# Altium project B802AA.PrjPcb
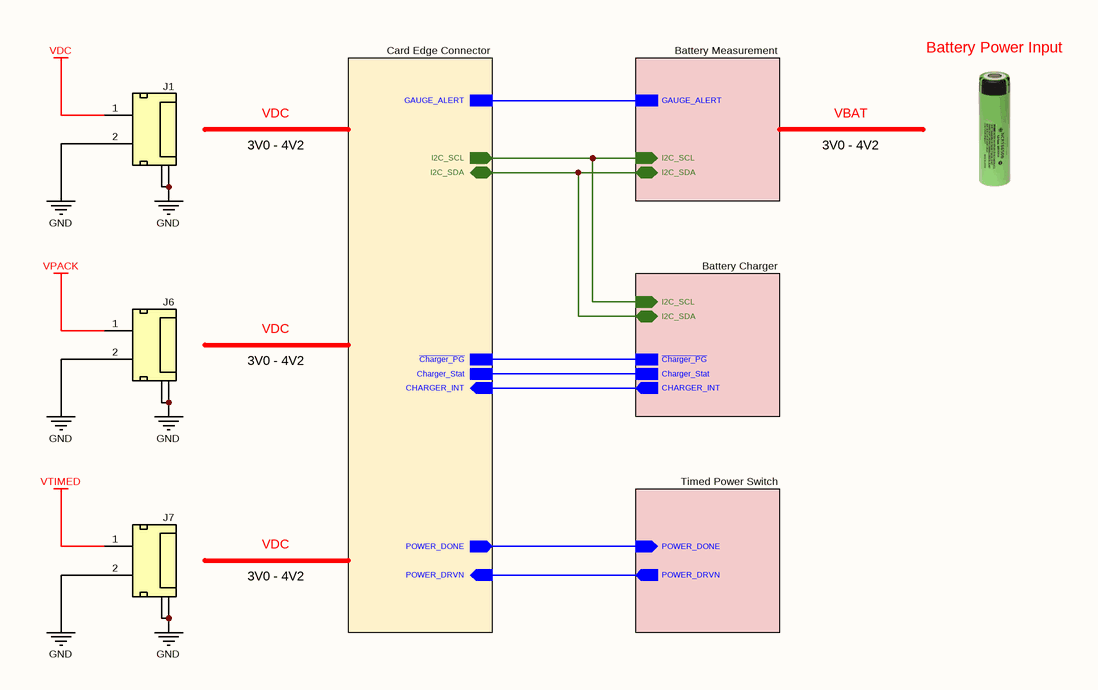
[diagram p0: Block Diagram.SchDoc]
Address1_: Buyuk Kayacik Mah. 4. OSB; Address2_: 103. Cad. No : 12; Address3_: Selcuklu / Konya; Address4_: Türkiye; Copyright_: Copyright 2022 STF Tarim (Commercial Secret); Customer_: STF Irrigation; Engineer_: Gunce Akkoyun; Git_Repo_Address_: www.github.com/akkoyun/B905AA; Module_ID_: B802AA; Organization_: STF Res-Dev; Product_Desc_: P101DA; Product_ID_: P101DA; Revision_: 00.00.01; Version_: R1
5 sheets, 52 parts. Net scope: hierarchical (ports join the sheet entries above them; power ports are global).
Board file: B802AA.PcbDoc
Sheets:
  Block Diagram.SchDoc
    Battery Measurement = Battery Measurement.SchDoc
    Battery Charger = Battery Charger.SchDoc
    Timed Power Switch = Timed Power Switch.SchDoc
    Card Edge Connector = Card Edge Connector.SchDoc

## Sheet Block Diagram.SchDoc: Block Diagram
size 292 x 193 mm; SheetNumber: 1; SheetTotal: 4

### Parts
J1  2P SMD Tunic Connector  [Connector_Tunic 2P]  (value not drawn)
J6  2P SMD Tunic Connector  [Connector_Tunic 2P]  (value not drawn)
J7  2P SMD Tunic Connector  [Connector_Tunic 2P]  (value not drawn)

### Sub-sheets
Battery Charger = Battery Charger.SchDoc: ~{Charger_PG}, Charger_Stat, I2C_SDA (bidir), I2C_SCL (in), CHARGER_INT (out)
Battery Measurement = Battery Measurement.SchDoc: GAUGE_ALERT, I2C_SDA (bidir), I2C_SCL (in)
Card Edge Connector = Card Edge Connector.SchDoc: POWER_DONE (out), POWER_DRVN (in), Charger_Stat, ~{Charger_PG}, CHARGER_INT (in), I2C_SDA (bidir), GAUGE_ALERT, I2C_SCL (out)
Timed Power Switch = Timed Power Switch.SchDoc: POWER_DONE (in), POWER_DRVN (out)

### Nets
GND: J1.2(Pin2) J1.3(GND) J1.4(GND) J6.2(Pin2) J6.3(GND) J6.4(GND) J7.2(Pin2) J7.3(GND) J7.4(GND)
VDC: J1.1(Pin1)
VPACK: J6.1(Pin1)
VTIMED: J7.1(Pin1)
~{Charger_PG}: sheet Battery Charger/~{Charger_PG}, sheet Card Edge Connector/~{Charger_PG}
CHARGER_INT: sheet Battery Charger/CHARGER_INT, sheet Card Edge Connector/CHARGER_INT
Charger_Stat: sheet Battery Charger/Charger_Stat, sheet Card Edge Connector/Charger_Stat
GAUGE_ALERT: sheet Battery Measurement/GAUGE_ALERT, sheet Card Edge Connector/GAUGE_ALERT
I2C_SCL: sheet Battery Measurement/I2C_SCL, sheet Battery Charger/I2C_SCL, sheet Card Edge Connector/I2C_SCL
I2C_SDA: sheet Battery Measurement/I2C_SDA, sheet Battery Charger/I2C_SDA, sheet Card Edge Connector/I2C_SDA
POWER_DONE: sheet Timed Power Switch/POWER_DONE, sheet Card Edge Connector/POWER_DONE
POWER_DRVN: sheet Timed Power Switch/POWER_DRVN, sheet Card Edge Connector/POWER_DRVN

### Notes on the sheet
- Battery Power Input
- VDC
- 3V0 - 4V2
- VBAT
- © 2021 All rights reserved.
  This document may not, in whole or in part, be copied, photocopied, reproduced, translated or converted to any electronic or machine readable from without prior written permission of Mehmet Günce Akkoyun.
  Engineer contact : akkoyun@me.com
- Property of
- Engineer :
- Date :
- Size :
- A4
- Time :
- Project :
- Page :
- /
- Customer :
- Product ID :
- Module ID :
- Version :
- File :
- Revision :

### Library data of the parts
J1 J6 J7 = Connector - Mini Tunic 2P (1.25): Mini Tunic Connector with 2P; Manufacturer Name: Molex; Manufacturer Part Number: 53261-0271; Height: 3.55mm; Mouser Part Number: 538-53261-0271; ROHS: Yes

## Sheet Battery Measurement.SchDoc: Battery Measurement
size 292 x 193 mm; SheetNumber: 3; SheetTotal: 4
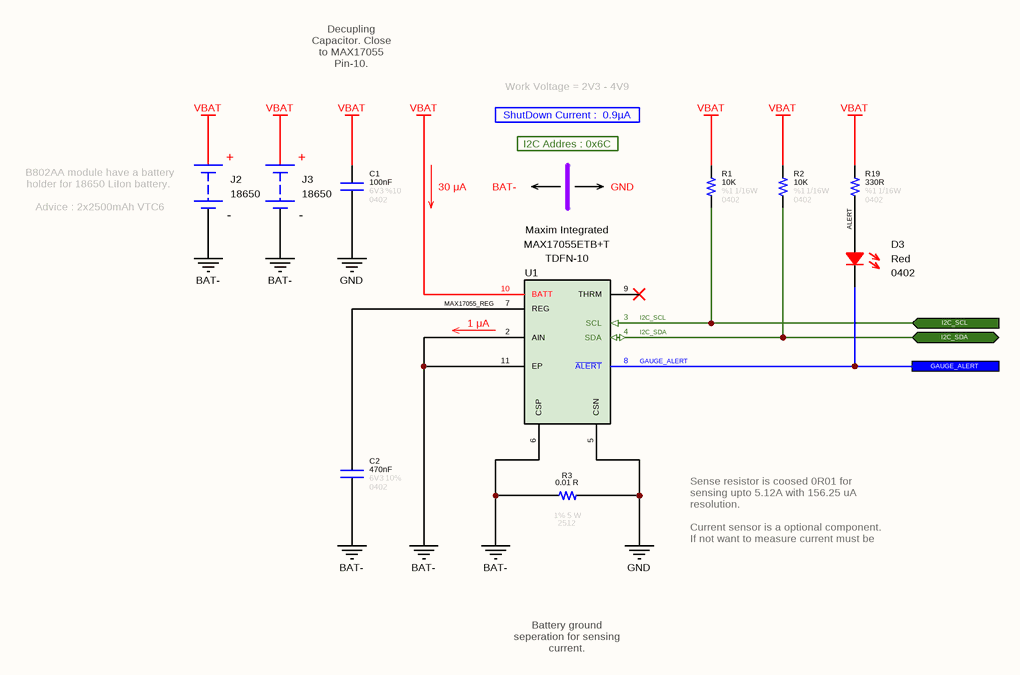
[diagram p1: Battery Measurement.SchDoc]

### Parts
C1  value 100nF  Tolerance: %10  Voltage: 6V3  Case: 0402  [CAPACITOR_0402]  (hidden comment: Capacitor - 100nF [0402] (Ceramic))
C2  value 470nF  Tolerance: 10%  Case: 0402  Voltage: 6V3  [CAPACITOR_0402]  (hidden comment: Capacitor - 470nF [0402] (Ceramic))
D3  Case: 0402  Color: Red  [LED_0402]  (hidden comment: SMD LED (Red))
J2  Battery Size: 18650  [BATTERY_HOLDER - Bat]  (hidden comment: 54)
J3  Battery Size: 18650  [BATTERY_HOLDER - Bat]  (hidden comment: 54)
R1  value 10K  Tolerance: %1  Case: 0402  Power: 1/16W  [RESISTOR_0402]  (hidden comment: 10K - 0402 - %1 - 1/16W)
R2  value 10K  Tolerance: %1  Case: 0402  Power: 1/16W  [RESISTOR_0402]  (hidden comment: 10K - 0402 - %1 - 1/16W)
R3  value 0.01 R  Tolerance: 1%  Power: 5 W  Case: 2512  [RESISTOR_2512 SHUNT]  (hidden comment: 0R01 - 2512 - %1 - 5W)
R19  value 330R  Case: 0402  Tolerance: %1  Power: 1/16W  [RESISTOR_0402]  (hidden comment: 330R - 0402 - %1 - 1/16W)
U1  Manufacturer Name: Maxim Integrated  [TDFN-10]  (hidden comment: MAX17055ETB+T)

### Ports
GAUGE_ALERT, I2C_SCL (in), I2C_SDA (bidir)

### Nets
BAT-: C2.1 J2.2(BAT-) J3.2(BAT-) R3.2 U1.2(AIN) U1.6(CSP) U1.11(EP)
GND: C1.1 R3.1 U1.5(CSN)
VBAT: C1.2 J2.1(BAT+) J3.1(BAT+) R1.2 R2.2 R19.2 U1.10(BATT)
ALERT: D3.2 R19.1
GAUGE_ALERT: D3.1 U1.8(~{ALERT}) ; port GAUGE_ALERT
I2C_SCL: R1.1 U1.3(SCL) ; port I2C_SCL
I2C_SDA: R2.1 U1.4(SDA) ; port I2C_SDA
MAX17055_REG: C2.2 U1.7(REG)

Not connected (* = marked no-connect by the designer): U1 9(THRM)*

### Notes on the sheet
- Decupling Capacitor. Close to MAX17055 Pin-10.
- ShutDown Current :  0.9µA
- Work Voltage = 2V3 - 4V9
- 30 μA
- I2C Addres : 0x6C
- BAT-
- GND
- (near J2) B802AA module have a battery holder for 18650 LiIon battery.
  Advice : 2x2500mAh VTC6
- (near U1) 1 μA
- Sense resistor is coosed 0R01 for sensing upto 5.12A with 156.25 uA resolution.
  Current sensor is a optional component. If not want to measure current must be connect PACK- to GND.
- Battery ground seperation for sensing current.
- © 2021 All rights reserved.
  This document may not, in whole or in part, be copied, photocopied, reproduced, translated or converted to any electronic or machine readable from without prior written permission of Mehmet Günce Akkoyun.
  Engineer contact : akkoyun@me.com
- Property of
- Engineer :
- Date :
- Size :
- A4
- Time :
- Project :
- Page :
- /
- Customer :
- Product ID :
- Module ID :
- Version :
- File :
- Revision :
- (in symbol Connector - 18650 Battery Holder) +; -

### Library data of the parts
C1 = Capacitor - 100nF [0402-6V3]: Capacitor - 100nF [0402-6V3] (Ceramic); Manufacturer Name: AVX; Manufacturer Part Number: 04026D104KAT4A; ComponentLink1Description: Mouser; ComponentLink1URL: https://www.mouser.com.tr/ProductDetail/AVX/04026D104KAT4A?qs=sGAEpiMZZMs0AnBnWHyRQPg4iYkCw7IMED%2F4kpqgf7w%3D; ComponentLink2Description: DataSheet; ComponentLink2URL: https://www.mouser.com.tr/datasheet/2/40/cx5r-776519.pdf
C2 = Capacitor - 470 nF [0402-6V3]: Multilayer Ceramic Capacitors - SMD - 6.3V 470nF X7R 0402 10%; Manufacturer Name: AVX; Manufacturer Part Number: 04026C474KAT2A
D3 = Diode - LED (0402-Red): Standard LEDs - SMD MINI-MOLD ULTRA COMPACT RED; Manufacturer Name: ROHM Semiconductor; Manufacturer Part Number: SML-P12VTT86R; ROHS: Yes; ComponentLink1Description: DataSheet; ComponentLink1URL: https://www.mouser.com.tr/datasheet/2/348/sml-p1-e-1139198.pdf; ComponentLink2Description: Mouser; ComponentLink2URL: https://www.mouser.com.tr/ProductDetail/ROHM-Semiconductor/SML-P12U2TT86R?qs=sGAEpiMZZMseGfSY3csMkRIBDsfU3UCXJTULB5gem9Ta%252Bp%252BvZ709fg%3D%3D
J2 J3 = Connector - 18650 Battery Holder: BATTERY CONTACT CLP 18650 PC PIN; Manufacturer Name: Keystone Electronics; Manufacturer Part Number: 54; Product Type: Battery Holders; RoHS: Yes
R1 R2 = Resistor - 10K [0402]: Thick Film Resistors - SMD 1/16 W 10 KOhm 1%; Manufacturer Name: Vishay; Manufacturer Part Number: CRCW040210K0FKED; ComponentLink1Description: DataSheet; ComponentLink1URL: https://www.mouser.com.tr/datasheet/2/427/dcrcwe3-1762152.pdf; ComponentLink2Description: Mouser; ComponentLink2URL: https://www.mouser.com.tr/ProductDetail/Vishay-Dale/CRCW040210K0FKED?qs=sGAEpiMZZMu61qfTUdNhG2DpbjADlD3GcalbOv9utCY%3D
R3 = Resistor - 0R01 [2512]: Shunt Resistors - SMD 5 W 0.01 Ohm 1%; Manufacturer Part Number: TLRH3APTTE10L0F; Manufacturer Name: KOA Speer
R19 = Resistor - 330R [0402]: Thick Film Resistors - SMD 1/16 W 330 Ohm 1%; Manufacturer Name: Vishay; Manufacturer Part Number: CRCW0402330RFKED; ComponentLink1Description: DataSheet; ComponentLink1URL: https://www.mouser.com.tr/datasheet/2/427/dcrcwe3-1762152.pdf; ComponentLink2Description: Mouser; ComponentLink2URL: https://www.mouser.com.tr/ProductDetail/Vishay-Dale/CRCW0402330RFKED?qs=sGAEpiMZZMu61qfTUdNhG2DpbjADlD3GGS6SwBlLi5Q%3D
U1 = IC - MAX17055: IC FUEL GAUGE MODELGAUGE 10TDFN; Minimum Operating Temperature: - 40 C; Product Type: Battery Gauge; Maximum Operating Temperature: + 85 C; Manufacturer Part Number: MAX17055ETB+T; Case: TDFN-10

## Sheet Battery Charger.SchDoc: Battery Charger
size 292 x 193 mm; SheetNumber: 4; SheetTotal: 5
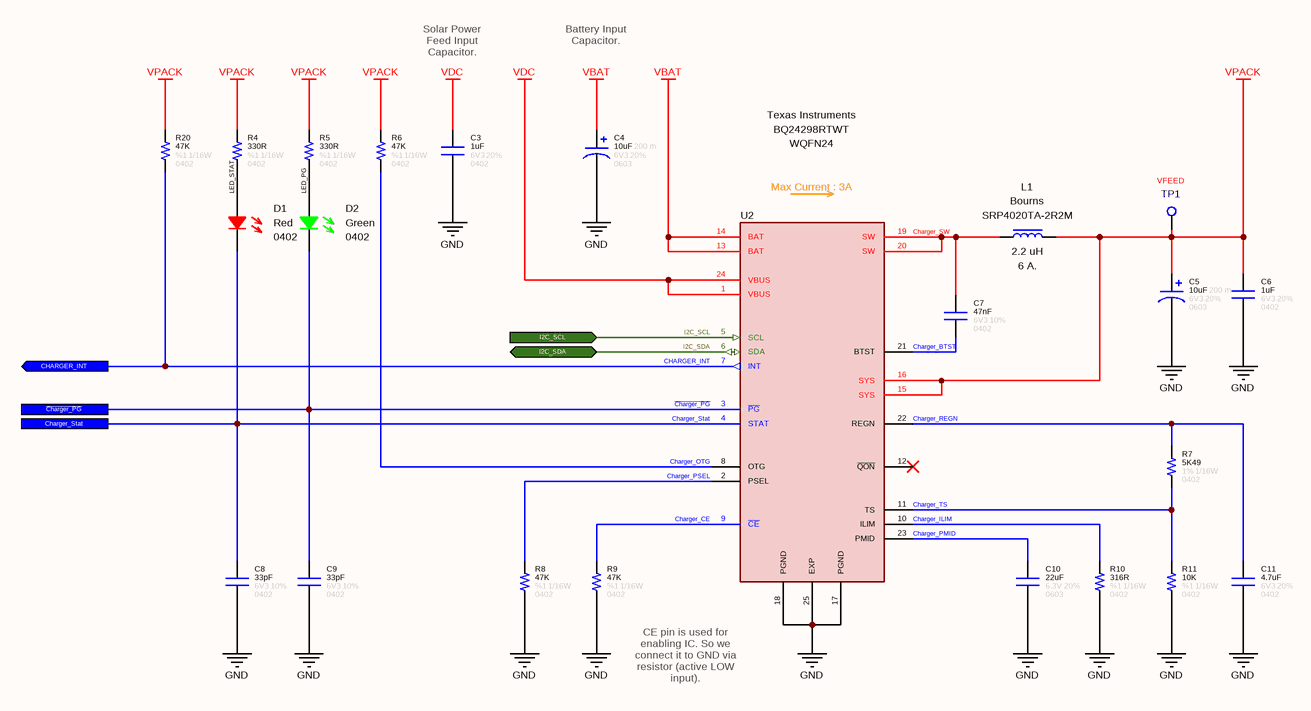
[diagram p2: Battery Charger.SchDoc]

### Parts
C3  value 1uF  Tolerance: 20%  Case: 0402  Voltage: 6V3  [CAPACITOR_0402]  (hidden comment: Capacitor - 1uF [0402] (Ceramic))
C4  value 10uF  ESR: 200 m  Tolerance: 20%  Case: 0603  Voltage: 6V3  [CAPACITOR_0603_Tantalum]  (hidden comment: Capacitor - 10uF [0603] (Tantalum))
C5  value 10uF  ESR: 200 m  Tolerance: 20%  Case: 0603  Voltage: 6V3  [CAPACITOR_0603_Tantalum]  (hidden comment: Capacitor - 10uF [0603] (Tantalum))
C6  value 1uF  Tolerance: 20%  Case: 0402  Voltage: 6V3  [CAPACITOR_0402]  (hidden comment: Capacitor - 1uF [0402] (Ceramic))
C7  value 47nF  Tolerance: 10%  Case: 0402  Voltage: 6V3  [CAPACITOR_0402]  (hidden comment: Capacitor - 47nF [0402] (Ceramic))
C8  value 33pF  Tolerance: 10%  Case: 0402  Voltage: 6V3  [CAPACITOR_0402]  (hidden comment: Capacitor - 33pF [0402] (Ceramic))
C9  value 33pF  Tolerance: 10%  Case: 0402  Voltage: 6V3  [CAPACITOR_0402]  (hidden comment: Capacitor - 33pF [0402] (Ceramic))
C10  value 22uF  Tolerance: 20%  Case: 0603  Voltage: 6.3V  [CAPACITOR_0603]  (hidden comment: Capacitor - 22uF [0603] (Ceramic))
C11  value 4.7uF  Tolerance: 20%  Case: 0402  Voltage: 6V3  [CAPACITOR_0402]  (hidden comment: Capacitor - 4.7uF [0402] (Ceramic))
D1  Case: 0402  Color: Red  [LED_0402]  (hidden comment: SMD LED (Red))
D2  Case: 0402  Color: Green  [LED_0402]  (hidden comment: SMD LED (Green))
L1  value 2.2 uH  Manufacturer Name: Bourns  Maximum DC Current: 6 A.  [SRP4020TA]  (hidden comment: SRP4020TA-2R2M)
R4  value 330R  Case: 0402  Tolerance: %1  Power: 1/16W  [RESISTOR_0402]  (hidden comment: 330R - 0402 - %1 - 1/16W)
R5  value 330R  Case: 0402  Tolerance: %1  Power: 1/16W  [RESISTOR_0402]  (hidden comment: 330R - 0402 - %1 - 1/16W)
R6  value 47K  Tolerance: %1  Case: 0402  Power: 1/16W  [RESISTOR_0402]  (hidden comment: 47K - 0402 - %1 - 1/16W)
R7  value 5K49  Power: 1/16W  Case: 0402  Tolerance: 1%  [RESISTOR_0402]  (hidden comment: 5K49 - 0402 - %1 - 1/16W)
R8  value 47K  Tolerance: %1  Case: 0402  Power: 1/16W  [RESISTOR_0402]  (hidden comment: 47K - 0402 - %1 - 1/16W)
R9  value 47K  Tolerance: %1  Case: 0402  Power: 1/16W  [RESISTOR_0402]  (hidden comment: 47K - 0402 - %1 - 1/16W)
R10  value 316R  Power: 1/16W  Case: 0402  Tolerance: %1  [RESISTOR_0402]  (hidden comment: 316R - 0402 - %1 - 1/16W)
R11  value 10K  Tolerance: %1  Case: 0402  Power: 1/16W  [RESISTOR_0402]  (hidden comment: 10K - 0402 - %1 - 1/16W)
R20  value 47K  Tolerance: %1  Case: 0402  Power: 1/16W  [RESISTOR_0402]  (hidden comment: 47K - 0402 - %1 - 1/16W)
TP1  Name: VFEED  [Test_Point]  (no BOM)
U2  Manufacturer Name: Texas Instruments  Case: WQFN24  [WQFN-24]  (hidden comment: BQ24298RTWT)

### Ports
CHARGER_INT (out), Charger_Stat, I2C_SCL (in), I2C_SDA (bidir), ~{Charger_PG}

### Nets
GND: C3.1 C4.2 C5.2 C6.1 C8.1 C9.1 C10.1 C11.1 R8.1 R9.1 R10.1 R11.1 U2.17(PGND) U2.18(PGND) U2.25(EXP)
VBAT: C4.1 U2.13(BAT) U2.14(BAT)
VDC: C3.2 U2.1(VBUS) U2.24(VBUS)
VPACK: C5.1 C6.2 L1.2 R4.2 R5.2 R6.2 R20.2 TP1.1 U2.15(SYS) U2.16(SYS)
~{Charger_PG}: C9.2 D2.1 U2.3(~{PG}) ; port ~{Charger_PG}
Charger_BTST: C7.1 U2.21(BTST)
Charger_CE: R9.2 U2.9(~{CE})
Charger_ILIM: R10.2 U2.10(ILIM)
CHARGER_INT: R20.1 U2.7(INT) ; port CHARGER_INT
Charger_OTG: R6.1 U2.8(OTG)
Charger_PMID: C10.2 U2.23(PMID)
Charger_PSEL: R8.2 U2.2(PSEL)
Charger_REGN: C11.2 R7.2 U2.22(REGN)
Charger_Stat: C8.2 D1.1 U2.4(STAT) ; port Charger_Stat
Charger_SW: C7.2 L1.1 U2.19(SW) U2.20(SW)
Charger_TS: R7.1 R11.2 U2.11(TS)
I2C_SCL: U2.5(SCL) ; port I2C_SCL
I2C_SDA: U2.6(SDA) ; port I2C_SDA
LED_PG: D2.2 R5.1
LED_STAT: D1.2 R4.1

Not connected (* = marked no-connect by the designer): U2 12(~{QON})*

### Notes on the sheet
- Solar Power Feed Input Capacitor.
- Battery Input Capacitor.
- CE pin is used for enabling IC. So we connect it to GND via resistor (active LOW input).
- © 2021 All rights reserved.
  This document may not, in whole or in part, be copied, photocopied, reproduced, translated or converted to any electronic or machine readable from without prior written permission of Mehmet Günce Akkoyun.
  Engineer contact : akkoyun@me.com
- Property of
- Engineer :
- Date :
- Size :
- A4
- Time :
- Project :
- Page :
- /
- Customer :
- Product ID :
- Module ID :
- Version :
- File :
- Revision :
- (in symbol IC - BQ24298RTWT) Max Current : 3A

### Library data of the parts
C3 C6 = Capacitor - 1uF [0402-6V3]: Multilayer Ceramic Capacitors - SMD - 6.3V 1uF X5R 0402 20%; Manufacturer Part Number: GRM153R60J105ME95D; Manufacturer Name: Murata
C4 C5 = Capacitor - 10uF [0603-6V3] (Tantalium): Capacitor - 10uF [0603] (Tantalium); Manufacturer Name: AVX; Manufacturer Part Number: F380J106MMAAH3; ComponentLink1Description: DataSheet; ComponentLink1URL: https://www.mouser.com.tr/datasheet/2/40/f38-775706.pdf; ComponentLink2Description: Mouser; ComponentLink2URL: https://www.mouser.com.tr/ProductDetail/AVX/F380J106MMAAH3?qs=sGAEpiMZZMtZ1n0r9vR22fixilZl6Mr8zRKleESmvcDFwZ4LSyC6Pg%3D%3D
C7 = Capacitor - 47nF [0402-6V3]: Multilayer Ceramic Capacitors - SMD - 6.3V 47nF X7R 0402 10%; Manufacturer Name: AVX; Manufacturer Part Number: 04026C473KAT2A
C8 C9 = Capacitor - 33pF [0402-6V3]: Manufacturer Name: Kemet; Manufacturer Part Number: C0402C330J9RACAUTO; ComponentLink1Description: DataSheet; ComponentLink1URL: https://api.kemet.com/component-edge/download/datasheet/C0402C330J9RACAUTO.pdf; ComponentLink2Description: Mouser; ComponentLink2URL: https://www.mouser.com/Search/Refine.aspx?Keyword=80-C0402C330J9RAUTO
C10 = Capacitor - 22uF [0603-6V3]: Multilayer Ceramic Capacitors - SMD - 6V3 22uF X5R 0603 20%; Manufacturer Part Number: GRM188R60J226MEA0D; Manufacturer Name: Murata
C11 = Capacitor - 4.7uF [0402-6V3]: Multilayer Ceramic Capacitors - SMD - 6V3 4.7uF X5R 0402 20%; Manufacturer Part Number: C0402C475M9PACTU; Manufacturer Name: KEMET
D1 = Diode - LED (0402-Red): as D3 on sheet Battery Measurement; ROHS: Yes; ComponentLink1Description: DataSheet; ComponentLink1URL: https://www.mouser.com.tr/datasheet/2/348/sml-p1-e-1139198.pdf; ComponentLink2Description: Mouser; ComponentLink2URL: https://www.mouser.com.tr/ProductDetail/ROHM-Semiconductor/SML-P12U2TT86R?qs=sGAEpiMZZMseGfSY3csMkRIBDsfU3UCXJTULB5gem9Ta%252Bp%252BvZ709fg%3D%3D
D2 = Diode - LED (0402-Green): Standard LEDs - SMD MINI-MOLD ULTRA COMPACT GREEN; Manufacturer Name: ROHM Semiconductor; Manufacturer Part Number: SML-P12MTT86R; ROHS: Yes; ComponentLink1Description: DataSheet; ComponentLink1URL: https://www.mouser.com.tr/datasheet/2/348/sml-p1-e-1139198.pdf; ComponentLink2Description: Mouser; ComponentLink2URL: https://www.mouser.com.tr/ProductDetail/ROHM-Semiconductor/SML-P12U2TT86R?qs=sGAEpiMZZMseGfSY3csMkRIBDsfU3UCXJTULB5gem9Ta%252Bp%252BvZ709fg%3D%3D
L1 = Inductor - SRP4020TA-2R2M: 6 A. 2.2uH Power inducator, 20% tol, SMD, RoHS; Maximum DC Resistance: 61 mOhms; Core Material: Carbonyl Powder; Maximum Operating Temperature: +150 C; ROHS: Yes; Tolerance: 20%; Minimum Operating Temperature: -40 C; Height: 1.8mm; Product Type: Fixed Inductors; Case: SMD; Manufacturer Part Number: SRP4020TA-2R2M
R4 R5 = Resistor - 330R [0402]: as R19 on sheet Battery Measurement; ComponentLink1Description: DataSheet; ComponentLink1URL: https://www.mouser.com.tr/datasheet/2/427/dcrcwe3-1762152.pdf; ComponentLink2Description: Mouser; ComponentLink2URL: https://www.mouser.com.tr/ProductDetail/Vishay-Dale/CRCW0402330RFKED?qs=sGAEpiMZZMu61qfTUdNhG2DpbjADlD3GGS6SwBlLi5Q%3D
R6 R8 R9 R20 = Resistor - 47K [0402]: Thick Film Resistors - SMD 1/16 W 47 KOhm 1%; Manufacturer Name: Vishay; Manufacturer Part Number: CRCW040247K0FKED; ComponentLink1Description: DataSheet; ComponentLink1URL: https://www.mouser.com.tr/datasheet/2/427/dcrcwe3-1762152.pdf; ComponentLink2Description: Mouser; ComponentLink2URL: https://www.mouser.com.tr/ProductDetail/Vishay-Dale/CRCW040247K0FKED?qs=sGAEpiMZZMu61qfTUdNhG2DpbjADlD3GL%252B3h1elTxqU%3D
R7 = Resistor - 5K49 [0402]: Thick Film Resistors - SMD 1/16 W 5.49 KOhm 1%; Manufacturer Name: Vishay; Manufacturer Part Number: CRCW04025K49FKED
R10 = Resistor - 316R [0402]: Thick Film Resistors - SMD 1/16 W 316 Ohm 1%; Manufacturer Name: Vishay; Manufacturer Part Number: CRCW0402316RFKED
R11 = Resistor - 10K [0402]: as R1 on sheet Battery Measurement; ComponentLink1Description: DataSheet; ComponentLink1URL: https://www.mouser.com.tr/datasheet/2/427/dcrcwe3-1762152.pdf; ComponentLink2Description: Mouser; ComponentLink2URL: https://www.mouser.com.tr/ProductDetail/Vishay-Dale/CRCW040210K0FKED?qs=sGAEpiMZZMu61qfTUdNhG2DpbjADlD3GcalbOv9utCY%3D
TP1 = Test Point
U2 = IC - BQ24298RTWT: I2C Controlled 3A Single Cell Charger; Operating Supply Current: 3 A.; Maximum Operating Temperature: +85; Minimum Operating Temperature: -40; ROHS: Yes; Product Type: Charge Management IC; Manufacturer Part Number: BQ24298RTWT

## Sheet Timed Power Switch.SchDoc: Timed Power Switch
size 292 x 193 mm; SheetNumber: 5; SheetTotal: 4
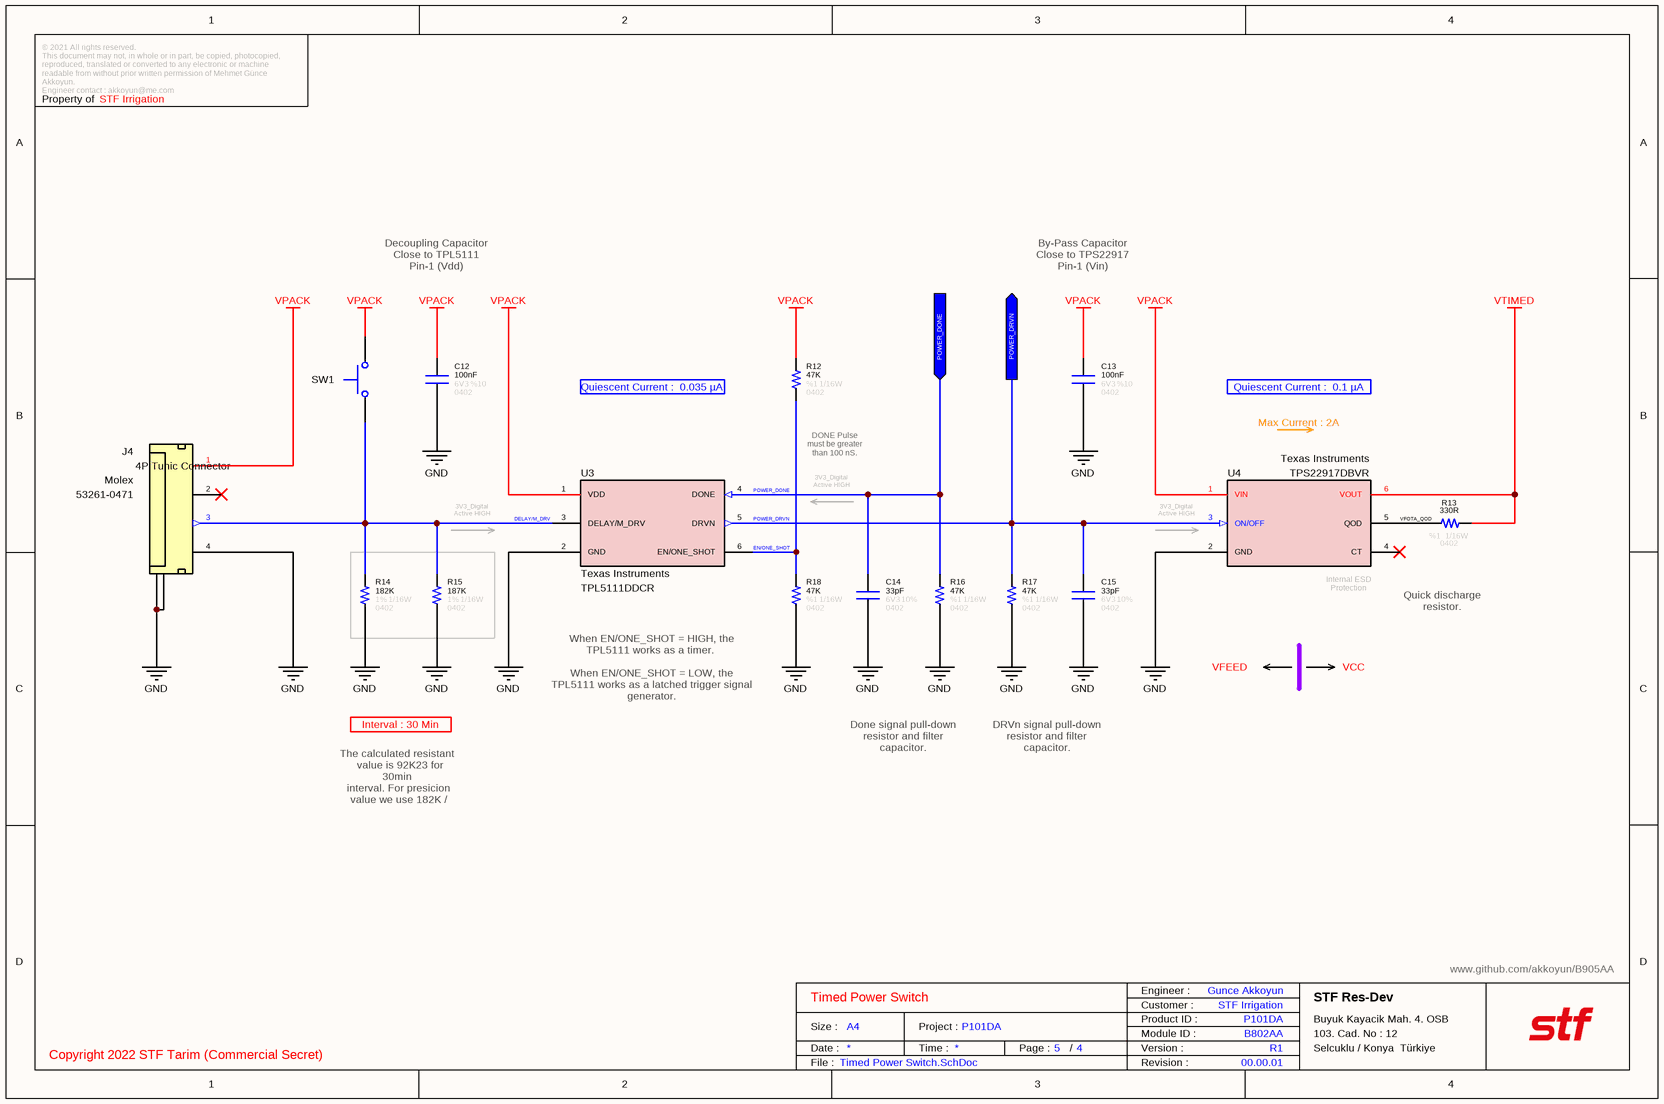
[diagram p3: Timed Power Switch.SchDoc]

### Parts
C12  value 100nF  Tolerance: %10  Voltage: 6V3  Case: 0402  [CAPACITOR_0402]  (hidden comment: Capacitor - 100nF [0402] (Ceramic))
C13  value 100nF  Tolerance: %10  Voltage: 6V3  Case: 0402  [CAPACITOR_0402]  (hidden comment: Capacitor - 100nF [0402] (Ceramic))
C14  value 33pF  Tolerance: 10%  Case: 0402  Voltage: 6V3  [CAPACITOR_0402]  (hidden comment: Capacitor - 33pF [0402] (Ceramic))
C15  value 33pF  Tolerance: 10%  Case: 0402  Voltage: 6V3  [CAPACITOR_0402]  (hidden comment: Capacitor - 33pF [0402] (Ceramic))
J4  Manufacturer Name: Molex  Manufacturer Part Number: 53261-0471  [Connector_Tunic 4P]  (hidden comment: 4P SMD Tunic Connector)
R12  value 47K  Tolerance: %1  Case: 0402  Power: 1/16W  [RESISTOR_0402]  (hidden comment: 47K - 0402 - %1 - 1/16W)
R13  value 330R  Case: 0402  Tolerance: %1  Power: 1/16W  [RESISTOR_0402]  (hidden comment: 330R - 0402 - %1 - 1/16W)
R14  value 182K  Power: 1/16W  Case: 0402  Tolerance: 1%  [RESISTOR_0402]  (hidden comment: 182K - 0402 - %1 - 1/16W)
R15  value 187K  Power: 1/16W  Case: 0402  Tolerance: 1%  [RESISTOR_0402]  (hidden comment: 187K - 0402 - %1 - 1/16W)
R16  value 47K  Tolerance: %1  Case: 0402  Power: 1/16W  [RESISTOR_0402]  (hidden comment: 47K - 0402 - %1 - 1/16W)
R17  value 47K  Tolerance: %1  Case: 0402  Power: 1/16W  [RESISTOR_0402]  (hidden comment: 47K - 0402 - %1 - 1/16W)
R18  value 47K  Tolerance: %1  Case: 0402  Power: 1/16W  [RESISTOR_0402]  (hidden comment: 47K - 0402 - %1 - 1/16W)
SW1  PTS526SK08SMTR2LFS  [PTS526_Switch]  (value not drawn)
U3  Manufacturer Name: Texas Instruments  [SOT-23-6]  (hidden comment: TPL5111DDCR)
U4  Manufacturer Part Number: TPS22917DBVR  Manufacturer Name: Texas Instruments  [SOT-23-6]  (hidden comment: Power Switch)

### Ports
POWER_DONE (in), POWER_DRVN (out)

### Nets
GND: C12.1 C13.1 C14.1 C15.1 J4.4(Pin-4) J4.5(GND) J4.6(GND) R14.1 R15.1 R16.1 R17.1 R18.1 U3.2(GND) U4.2(GND)
VPACK: C12.2 C13.2 J4.1(Pin-1) R12.2 SW1.2(COM) U3.1(VDD) U4.1(VIN)
VTIMED: R13.1 U4.6(VOUT)
DELAY/M_DRV: J4.3(Pin-3) R14.2 R15.2 SW1.1(NC) U3.3(DELAY/M_DRV)
EN/ONE_SHOT: R12.1 R18.2 U3.6(EN/ONE_SHOT)
POWER_DONE: C14.2 R16.2 U3.4(DONE) ; port POWER_DONE
POWER_DRVN: C15.2 R17.2 U3.5(DRVN) U4.3(ON/OFF) ; port POWER_DRVN
VFOTA_QOD: R13.2 U4.5(QOD)

Not connected (* = marked no-connect by the designer): J4 2(Pin-2)*; U4 4(CT)*

### Notes on the sheet
- Decoupling Capacitor
  Close to TPL5111
  Pin-1 (Vdd)
- By-Pass Capacitor
  Close to TPS22917
  Pin-1 (Vin)
- Quiescent Current :  0.035 µA
- Quiescent Current :  0.1 µA
- (near R12) DONE Pulse must be greater than 100 nS.
- (near U4) Max Current : 2A
- 3V3_Digital
  Active HIGH
- (near U4) 3V3_Digital
  Active HIGH
- (near U4) Internal ESD Protection
- (near U4) Quick discharge resistor.
- VFEED
- VCC
- Interval : 30 Min
- When EN/ONE_SHOT = HIGH, the TPL5111 works as a timer.
  When EN/ONE_SHOT = LOW, the TPL5111 works as a latched trigger signal generator.
- Done signal pull-down resistor and filter capacitor.
- DRVn signal pull-down resistor and filter capacitor.
- The calculated resistant
  value is 92K23 for 30min
  interval. For presicion
  value we use 182K /
  187K parallel.
- © 2021 All rights reserved.
  This document may not, in whole or in part, be copied, photocopied, reproduced, translated or converted to any electronic or machine readable from without prior written permission of Mehmet Günce Akkoyun.
  Engineer contact : akkoyun@me.com
- Property of
- Engineer :
- Date :
- Size :
- A4
- Time :
- Project :
- Page :
- /
- Customer :
- Product ID :
- Module ID :
- Version :
- File :
- Revision :
- (in symbol Connector - Mini Tunic 4P (1.25)) 4P Tunic Connector

### Library data of the parts
C12 C13 = Capacitor - 100nF [0402-6V3]: as C1 on sheet Battery Measurement; ComponentLink1Description: Mouser; ComponentLink1URL: https://www.mouser.com.tr/ProductDetail/AVX/04026D104KAT4A?qs=sGAEpiMZZMs0AnBnWHyRQPg4iYkCw7IMED%2F4kpqgf7w%3D; ComponentLink2Description: DataSheet; ComponentLink2URL: https://www.mouser.com.tr/datasheet/2/40/cx5r-776519.pdf
C14 C15 = Capacitor - 33pF [0402-6V3]: as C8 on sheet Battery Charger; ComponentLink1Description: DataSheet; ComponentLink1URL: https://api.kemet.com/component-edge/download/datasheet/C0402C330J9RACAUTO.pdf; ComponentLink2Description: Mouser; ComponentLink2URL: https://www.mouser.com/Search/Refine.aspx?Keyword=80-C0402C330J9RAUTO
J4 = Connector - Mini Tunic 4P (1.25): Mini Tunic Connector with 4P; Pitch: 1.25mm; Position: 4; ROHS: Yes; ComponentLink1Description: DataSheet; ComponentLink1URL: https://www.mouser.com.tr/datasheet/2/276/0532610471_PCB_HEADERS-170942.pdf; ComponentLink2Description: Mouser; ComponentLink2URL: https://www.mouser.com.tr/ProductDetail/Molex/53261-0471?qs=%2Fha2pyFaduhLhIsk8tywtK7BwWtguBSP4XxyDBTOTfs%3D; Case: SMD
R12 R16-R18 = Resistor - 47K [0402]: as R6 on sheet Battery Charger; ComponentLink1Description: DataSheet; ComponentLink1URL: https://www.mouser.com.tr/datasheet/2/427/dcrcwe3-1762152.pdf; ComponentLink2Description: Mouser; ComponentLink2URL: https://www.mouser.com.tr/ProductDetail/Vishay-Dale/CRCW040247K0FKED?qs=sGAEpiMZZMu61qfTUdNhG2DpbjADlD3GL%252B3h1elTxqU%3D
R13 = Resistor - 330R [0402]: as R19 on sheet Battery Measurement; ComponentLink1Description: DataSheet; ComponentLink1URL: https://www.mouser.com.tr/datasheet/2/427/dcrcwe3-1762152.pdf; ComponentLink2Description: Mouser; ComponentLink2URL: https://www.mouser.com.tr/ProductDetail/Vishay-Dale/CRCW0402330RFKED?qs=sGAEpiMZZMu61qfTUdNhG2DpbjADlD3GGS6SwBlLi5Q%3D
R14 = Resistor - 182K [0402]: Thick Film Resistors - SMD 1/16 W 182 KOhm 1%; Manufacturer Name: Vishay; Manufacturer Part Number: CRCW0402182KFKEDC
R15 = Resistor - 187K [0402]: Thick Film Resistors - SMD 1/16 W 187 KOhm 1%; Manufacturer Name: Vishay; Manufacturer Part Number: CRCW0402182KFKEDC
SW1 = Switch - Push Button: Switch Tactile N.O. SPST Flush Round Button Gull Wing 0.05A 12VDC 200000Cycles 2.45N SMD T/R; Manufacturer Name: C&K Switches; Current Rating: 50 mA; Contact Form: SPST; Product Type: Tactile Switches; RoHS: Yes; Voltage Rating: 12 VDC; Case: SMD; Manufacturer Part Number: PTS526SK08SMTR2LFS
U3 = IC - TPL5111: NANO-POWER SYSTEM TIMER FOR POWE; Maximum Operating Temperature: + 105 C; Minimum Operating Temperature: - 40 C; RoHS: Yes; Case: SOT-23-6; Product Type: Timers; Manufacturer Part Number: TPL5111DDCR
U4 = IC - TPS22917: Power Switch MosFet; Height: 1.45mm; ComponentLink1Description: DataSheet; ComponentLink1URL: http://www.ti.com/lit/gpn/tps22917; ComponentLink2Description: Mouser; ComponentLink2URL: https://www.mouser.com/Search/Refine.aspx?Keyword=595-TPS22917DBVR; Case: SOT-23-6

## Sheet Card Edge Connector.SchDoc: Card Edge Connector
size 292 x 193 mm; SheetNumber: 2; SheetTotal: 5
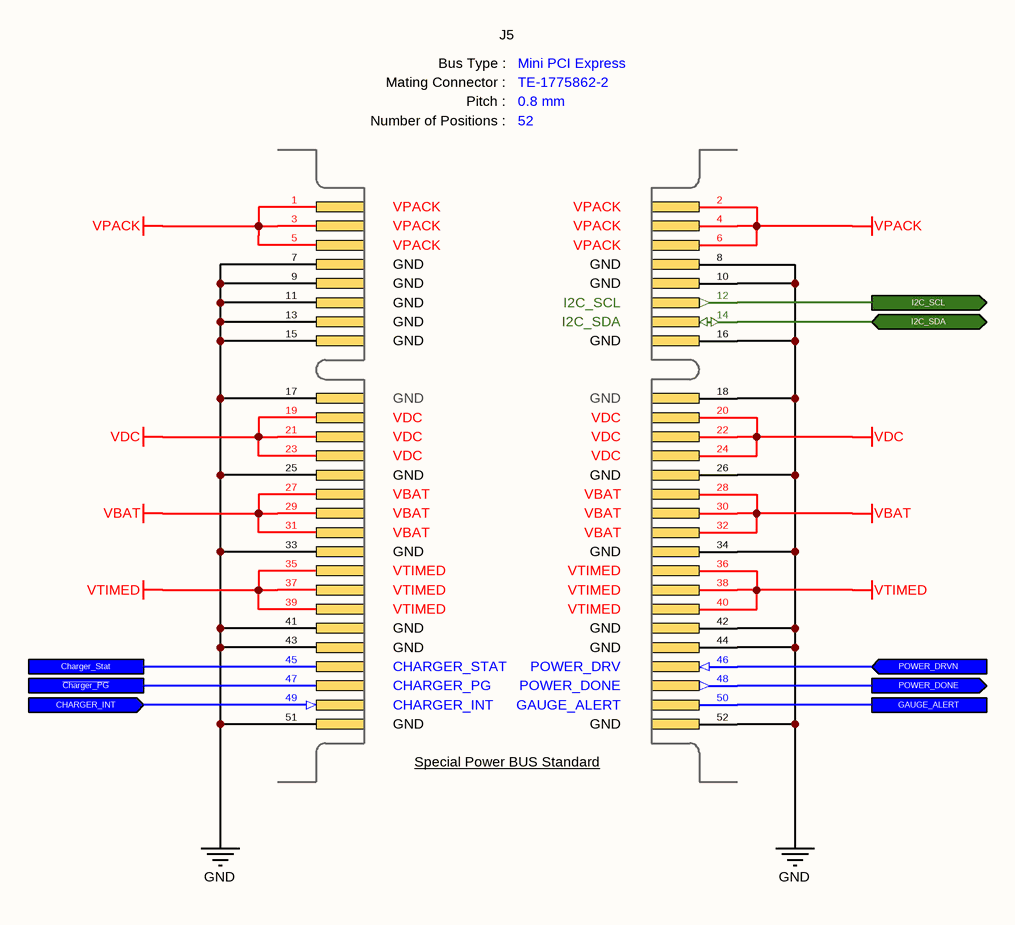
[diagram p4: Card Edge Connector.SchDoc]

### Parts
J5  BUS Type: Mini PCI Express  Mating Connector: TE-1775862-2  Pitch: 0.8 mm  Number of Positions: 52  [PCB - Mini PCI Express]  (hidden comment: Connector - Mini PCI-E [Power])  (no BOM)

### Ports
CHARGER_INT (in), Charger_Stat, GAUGE_ALERT, I2C_SCL (out), I2C_SDA (bidir), POWER_DONE (out), POWER_DRVN (in), ~{Charger_PG}

### Nets
GND: J5.7(Pin-7) J5.8(Pin-8) J5.9(Pin-9) J5.10(Pin-10) J5.11(Pin-11) J5.13(Pin-13) J5.15(Pin-15) J5.16(Pin-16) J5.17(Pin-17) J5.18(Pin-18) J5.25(Pin-25) J5.26(Pin-26) J5.33(Pin-33) J5.34(Pin-34) J5.41(Pin-41) J5.42(Pin-42) J5.43(Pin-43) J5.44(Pin-44) J5.51(Pin-51) J5.52(Pin-52)
VBAT: J5.27(Pin-27) J5.28(Pin-28) J5.29(Pin-29) J5.30(Pin-30) J5.31(Pin-31) J5.32(Pin-32)
VDC: J5.19(Pin-19) J5.20(Pin-20) J5.21(Pin-21) J5.22(Pin-22) J5.23(Pin-23) J5.24(Pin-24)
VPACK: J5.1(Pin-1) J5.2(Pin-2) J5.3(Pin-3) J5.4(Pin-4) J5.5(Pin-5) J5.6(Pin-6)
VTIMED: J5.35(Pin-35) J5.36(Pin-36) J5.37(Pin-37) J5.38(Pin-38) J5.39(Pin-39) J5.40(Pin-40)
~{Charger_PG}: J5.47(Pin-47) ; port ~{Charger_PG}
CHARGER_INT: J5.49(Pin-49) ; port CHARGER_INT
Charger_Stat: J5.45(Pin-45) ; port Charger_Stat
GAUGE_ALERT: J5.50(Pin-50) ; port GAUGE_ALERT
I2C_SCL: J5.12(Pin-12) ; port I2C_SCL
I2C_SDA: J5.14(Pin-14) ; port I2C_SDA
POWER_DONE: J5.48(Pin-48) ; port POWER_DONE
POWER_DRVN: J5.46(Pin-46) ; port POWER_DRVN

### Notes on the sheet
- © 2021 All rights reserved.
  This document may not, in whole or in part, be copied, photocopied, reproduced, translated or converted to any electronic or machine readable from without prior written permission of Mehmet Günce Akkoyun.
  Engineer contact : akkoyun@me.com
- Property of
- Engineer :
- Date :
- Size :
- A4
- Time :
- Project :
- Page :
- /
- Customer :
- Product ID :
- Module ID :
- Version :
- File :
- Revision :
- (in symbol Connector - Mini PCI-E [Power]) Bus Type :; Mating Connector :; Pitch :; Number of Positions :; VPACK; GND; I2C_SCL; I2C_SDA; VDC; VBAT; VTIMED; CHARGER_STAT; POWER_DRV; CHARGER_PG; POWER_DONE; CHARGER_INT; GAUGE_ALERT; Special Power BUS Standard

### Library data of the parts
J5 = Connector - Mini PCI-E [Power]: Mini PCI-Express gold finger connector.; System: Connector

## Nets that join several sheets
GND: Block Diagram (9 pins), Battery Measurement (C1.1 R3.1 U1.5), Battery Charger (15 pins), Timed Power Switch (14 pins), Card Edge Connector (20 pins)
VBAT: Battery Measurement (7 pins), Battery Charger (C4.1 U2.13 U2.14), Card Edge Connector (6 pins)
VDC: Block Diagram (J1.1), Battery Charger (C3.2 U2.1 U2.24), Card Edge Connector (6 pins)
VPACK: Block Diagram (J6.1), Battery Charger (10 pins), Timed Power Switch (7 pins), Card Edge Connector (6 pins)
VTIMED: Block Diagram (J7.1), Timed Power Switch (R13.1 U4.6), Card Edge Connector (6 pins)
~{Charger_PG}: Battery Charger (C9.2 D2.1 U2.3), Card Edge Connector (J5.47)
CHARGER_INT: Battery Charger (R20.1 U2.7), Card Edge Connector (J5.49)
Charger_Stat: Battery Charger (C8.2 D1.1 U2.4), Card Edge Connector (J5.45)
GAUGE_ALERT: Battery Measurement (D3.1 U1.8), Card Edge Connector (J5.50)
I2C_SCL: Battery Measurement (R1.1 U1.3), Battery Charger (U2.5), Card Edge Connector (J5.12)
I2C_SDA: Battery Measurement (R2.1 U1.4), Battery Charger (U2.6), Card Edge Connector (J5.14)
POWER_DONE: Timed Power Switch (C14.2 R16.2 U3.4), Card Edge Connector (J5.48)
POWER_DRVN: Timed Power Switch (C15.2 R17.2 U3.5 U4.3), Card Edge Connector (J5.46)